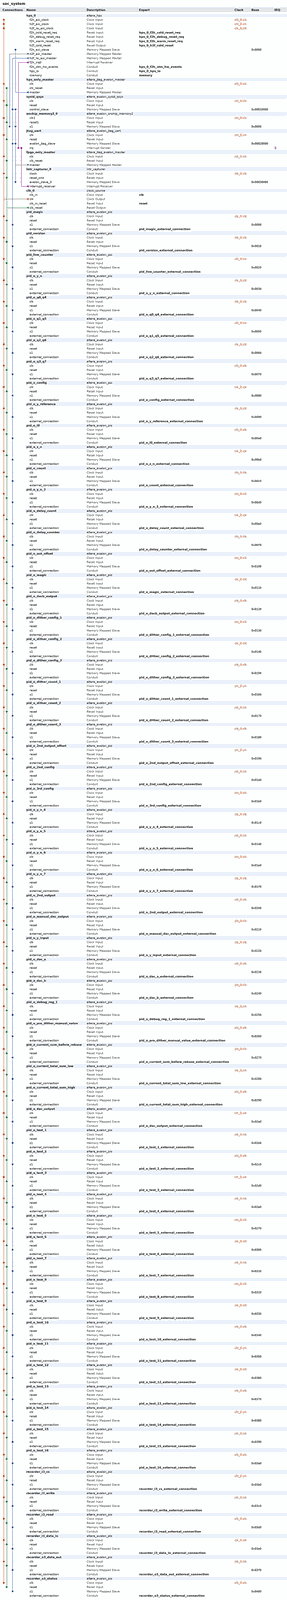
[diagram p0: system contents, whole]
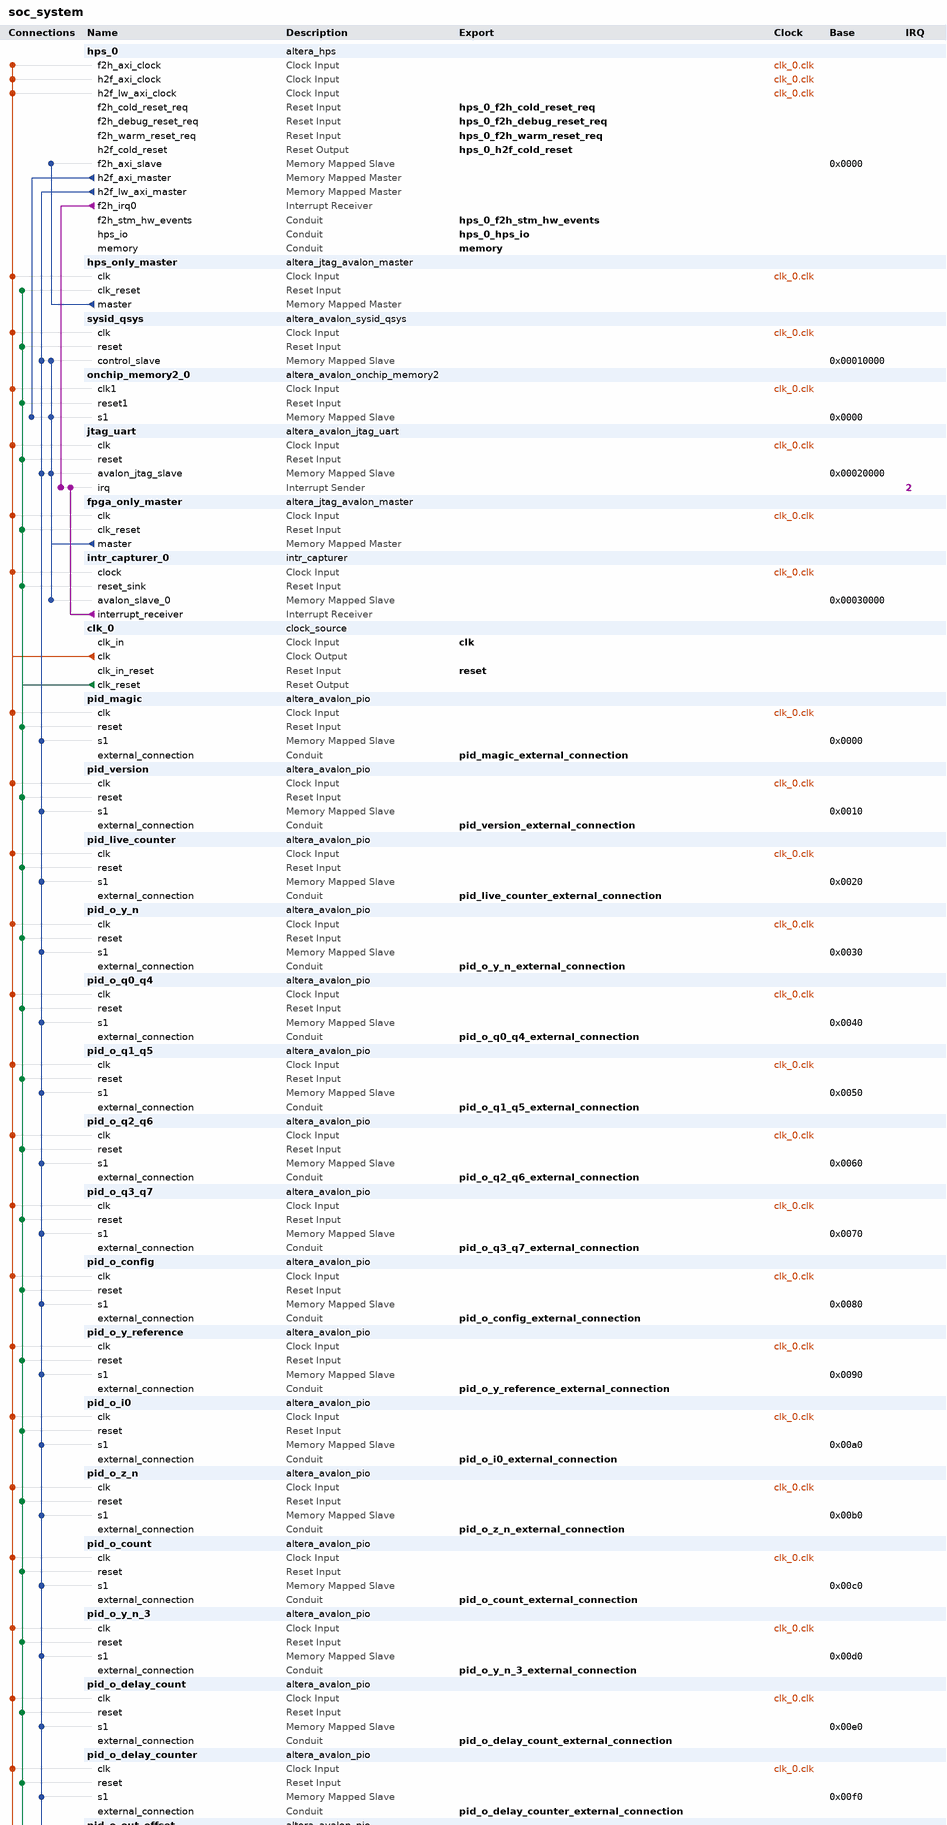
[diagram p1: system contents, upper part]
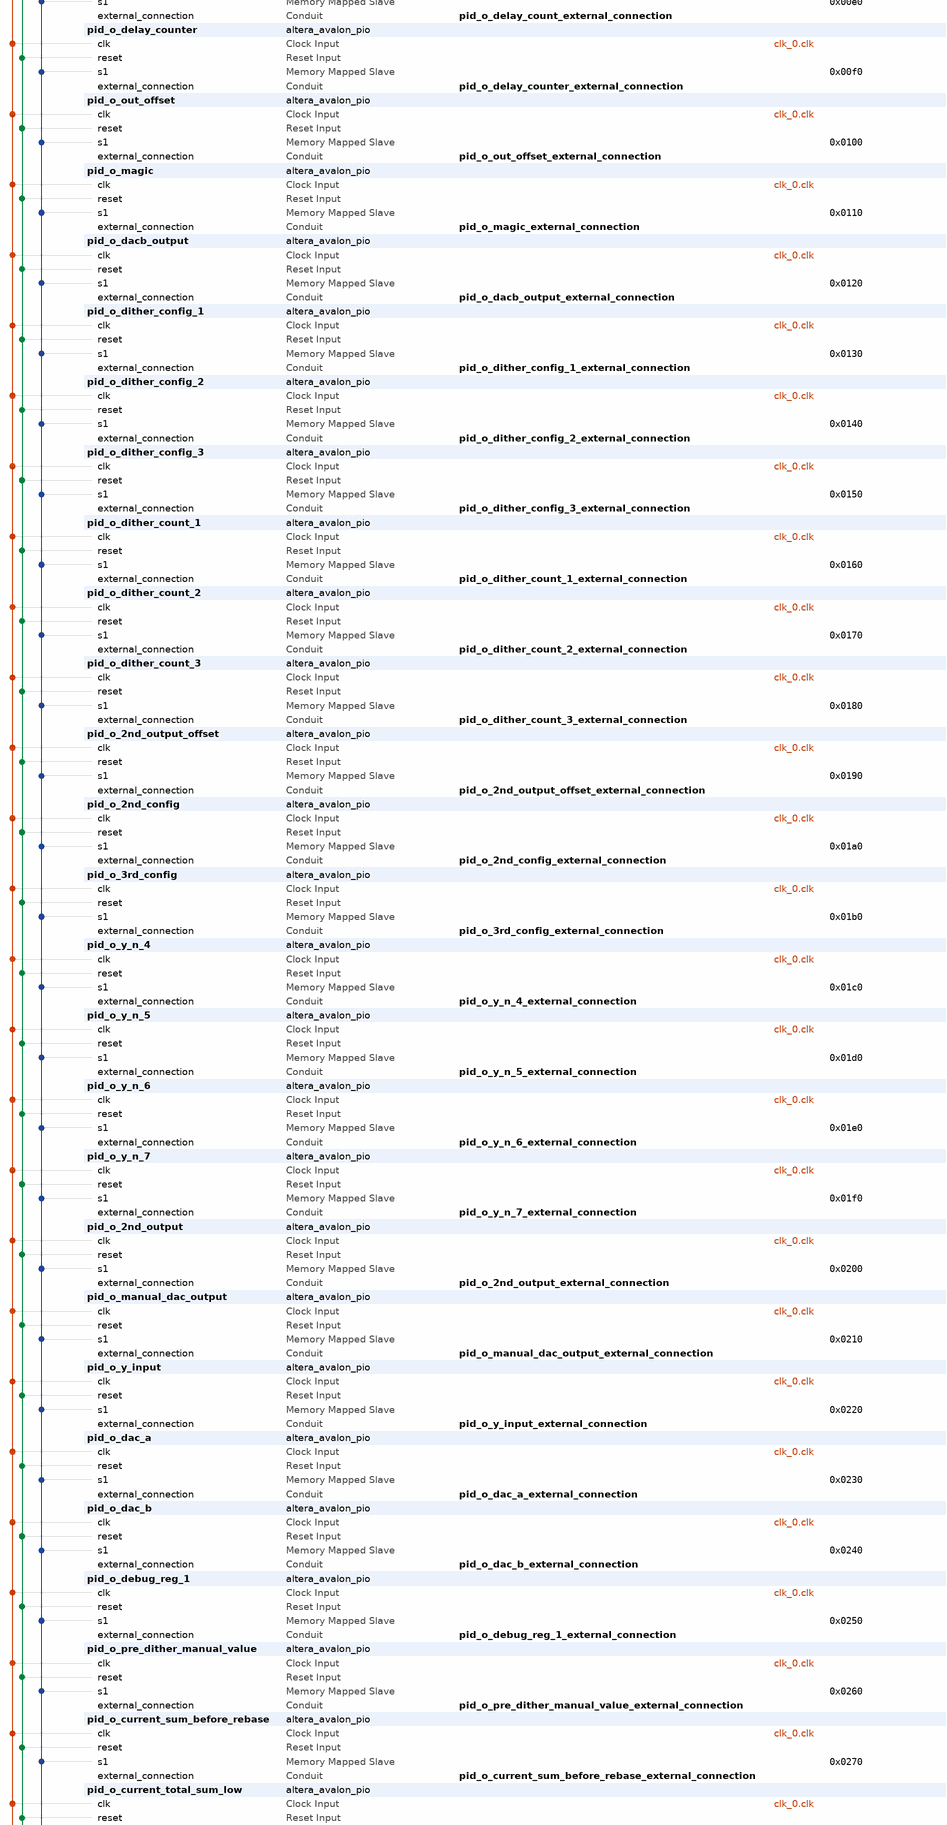
[diagram p2: system contents, middle part]
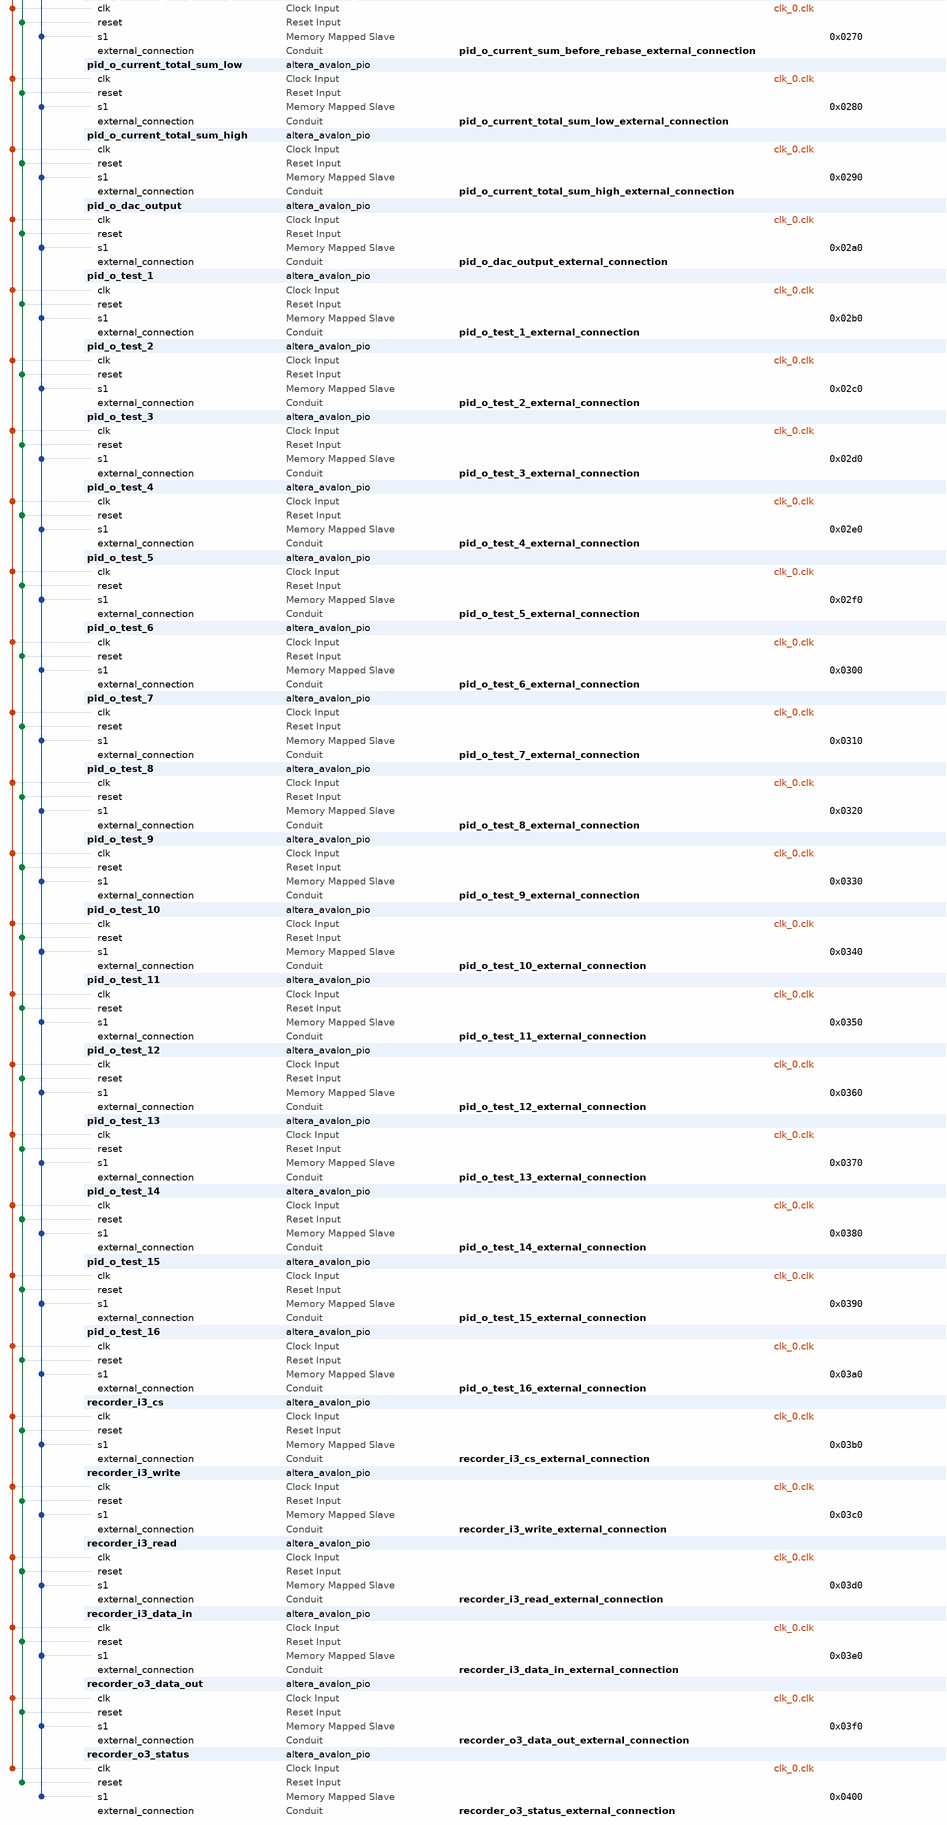
[diagram p3: system contents, lower part]
# Platform Designer (Qsys) system soc_system, Cyclone V 5CSEMA5F31C6
# Parameters at their usual value, and those the tool derives, are not listed.
package require -exact qsys 25.1
create_system soc_system
set_project_property DEVICE_FAMILY {Cyclone V}
set_project_property DEVICE 5CSEMA5F31C6

add_instance hps_0 altera_hps 25.1
set_instance_parameter_value hps_0 EMAC1_Mode RGMII
set_instance_parameter_value hps_0 EMAC1_PinMuxing {HPS I/O Set 0}
set_instance_parameter_value hps_0 F2SCLK_COLDRST_Enable true
set_instance_parameter_value hps_0 F2SCLK_DBGRST_Enable true
set_instance_parameter_value hps_0 F2SCLK_WARMRST_Enable true
set_instance_parameter_value hps_0 F2SINTERRUPT_Enable true
set_instance_parameter_value hps_0 F2S_Width 2
set_instance_parameter_value hps_0 FPGA_PERIPHERAL_OUTPUT_CLOCK_FREQ_EMAC0_GTX_CLK 100
set_instance_parameter_value hps_0 FPGA_PERIPHERAL_OUTPUT_CLOCK_FREQ_EMAC0_MD_CLK 100.0
set_instance_parameter_value hps_0 FPGA_PERIPHERAL_OUTPUT_CLOCK_FREQ_EMAC1_GTX_CLK 100
set_instance_parameter_value hps_0 FPGA_PERIPHERAL_OUTPUT_CLOCK_FREQ_EMAC1_MD_CLK 100.0
set_instance_parameter_value hps_0 HPS_PROTOCOL DDR3
set_instance_parameter_value hps_0 I2C0_Mode I2C
set_instance_parameter_value hps_0 I2C0_PinMuxing {HPS I/O Set 0}
set_instance_parameter_value hps_0 I2C1_Mode I2C
set_instance_parameter_value hps_0 I2C1_PinMuxing {HPS I/O Set 0}
set_instance_parameter_value hps_0 LWH2F_Enable true
set_instance_parameter_value hps_0 MEM_BANKADDR_WIDTH 3
set_instance_parameter_value hps_0 MEM_CLK_FREQ 400.0
set_instance_parameter_value hps_0 MEM_COL_ADDR_WIDTH 10
set_instance_parameter_value hps_0 MEM_DQ_WIDTH 32
set_instance_parameter_value hps_0 MEM_DRV_STR RZQ/7
set_instance_parameter_value hps_0 MEM_ROW_ADDR_WIDTH 15
set_instance_parameter_value hps_0 MEM_RTT_NOM RZQ/4
set_instance_parameter_value hps_0 MEM_RTT_WR RZQ/4
set_instance_parameter_value hps_0 MEM_TCL 11
set_instance_parameter_value hps_0 MEM_TFAW_NS 30.0
set_instance_parameter_value hps_0 MEM_TRAS_NS 35.0
set_instance_parameter_value hps_0 MEM_TRCD_NS 13.75
set_instance_parameter_value hps_0 MEM_TRFC_NS 260.0
set_instance_parameter_value hps_0 MEM_TRP_NS 13.75
set_instance_parameter_value hps_0 MEM_VENDOR JEDEC
set_instance_parameter_value hps_0 MEM_WTCL 8
set_instance_parameter_value hps_0 QSPI_Mode {1 SS}
set_instance_parameter_value hps_0 QSPI_PinMuxing {HPS I/O Set 0}
set_instance_parameter_value hps_0 REF_CLK_FREQ 25.0
set_instance_parameter_value hps_0 S2FCLK_COLDRST_Enable true
set_instance_parameter_value hps_0 S2FCLK_USER2CLK 5
set_instance_parameter_value hps_0 S2F_Width 2
set_instance_parameter_value hps_0 SDIO_Mode {4-bit Data}
set_instance_parameter_value hps_0 SDIO_PinMuxing {HPS I/O Set 0}
set_instance_parameter_value hps_0 SPIM1_Mode {Single Slave Select}
set_instance_parameter_value hps_0 SPIM1_PinMuxing {HPS I/O Set 0}
set_instance_parameter_value hps_0 STM_Enable true
set_instance_parameter_value hps_0 TIMING_BOARD_AC_SKEW 0.03
set_instance_parameter_value hps_0 TIMING_BOARD_AC_TO_CK_SKEW 0.0
set_instance_parameter_value hps_0 TIMING_BOARD_DQ_TO_DQS_SKEW 0.0
set_instance_parameter_value hps_0 TIMING_BOARD_MAX_CK_DELAY 0.03
set_instance_parameter_value hps_0 TIMING_BOARD_MAX_DQS_DELAY 0.02
set_instance_parameter_value hps_0 TIMING_BOARD_SKEW_BETWEEN_DQS 0.08
set_instance_parameter_value hps_0 TIMING_BOARD_SKEW_CKDQS_DIMM_MAX 0.16
set_instance_parameter_value hps_0 TIMING_BOARD_SKEW_CKDQS_DIMM_MIN 0.09
set_instance_parameter_value hps_0 TIMING_BOARD_SKEW_WITHIN_DQS 0.01
set_instance_parameter_value hps_0 TIMING_TDH 65
set_instance_parameter_value hps_0 TIMING_TDQSCK 255
set_instance_parameter_value hps_0 TIMING_TDQSQ 125
set_instance_parameter_value hps_0 TIMING_TDS 30
set_instance_parameter_value hps_0 TIMING_TIH 140
set_instance_parameter_value hps_0 TIMING_TIS 180
set_instance_parameter_value hps_0 TIMING_TQSH 0.4
set_instance_parameter_value hps_0 UART0_Mode {No Flow Control}
set_instance_parameter_value hps_0 UART0_PinMuxing {HPS I/O Set 0}
set_instance_parameter_value hps_0 USB1_Mode SDR
set_instance_parameter_value hps_0 USB1_PinMuxing {HPS I/O Set 0}
set_instance_parameter_value hps_0 desired_cfg_clk_mhz 100.0
set_instance_parameter_value hps_0 desired_qspi_clk_mhz 400.0

add_instance hps_only_master altera_jtag_avalon_master 25.1

add_instance sysid_qsys altera_avalon_sysid_qsys 25.1
set_instance_parameter_value sysid_qsys id -1395322110

add_instance onchip_memory2_0 altera_avalon_onchip_memory2 25.1
set_instance_parameter_value onchip_memory2_0 dataWidth 64
set_instance_parameter_value onchip_memory2_0 dualPort false
set_instance_parameter_value onchip_memory2_0 initMemContent true
set_instance_parameter_value onchip_memory2_0 initializationFileName onchip_memory2_0
set_instance_parameter_value onchip_memory2_0 memorySize 65536

add_instance jtag_uart altera_avalon_jtag_uart 25.1
set_instance_parameter_value jtag_uart allowMultipleConnections true
set_instance_parameter_value jtag_uart simInteractiveOptions INTERACTIVE_ASCII_OUTPUT

add_instance fpga_only_master altera_jtag_avalon_master 25.1

add_instance intr_capturer_0 intr_capturer 100.99.98.97

add_instance clk_0 clock_source 25.1
set_instance_parameter_value clk_0 clockFrequency 50000000

add_instance pid_magic altera_avalon_pio 25.1
set_instance_parameter_value pid_magic direction Input
set_instance_parameter_value pid_magic width 32

add_instance pid_version altera_avalon_pio 25.1
set_instance_parameter_value pid_version direction Input
set_instance_parameter_value pid_version width 32

add_instance pid_live_counter altera_avalon_pio 25.1
set_instance_parameter_value pid_live_counter direction Input
set_instance_parameter_value pid_live_counter width 32

add_instance pid_o_y_n altera_avalon_pio 25.1
set_instance_parameter_value pid_o_y_n direction InOut
set_instance_parameter_value pid_o_y_n width 32

add_instance pid_o_q0_q4 altera_avalon_pio 25.1
set_instance_parameter_value pid_o_q0_q4 direction InOut
set_instance_parameter_value pid_o_q0_q4 width 32

add_instance pid_o_q1_q5 altera_avalon_pio 25.1
set_instance_parameter_value pid_o_q1_q5 direction InOut
set_instance_parameter_value pid_o_q1_q5 width 32

add_instance pid_o_q2_q6 altera_avalon_pio 25.1
set_instance_parameter_value pid_o_q2_q6 direction InOut
set_instance_parameter_value pid_o_q2_q6 width 32

add_instance pid_o_q3_q7 altera_avalon_pio 25.1
set_instance_parameter_value pid_o_q3_q7 direction InOut
set_instance_parameter_value pid_o_q3_q7 width 32

add_instance pid_o_config altera_avalon_pio 25.1
set_instance_parameter_value pid_o_config direction InOut
set_instance_parameter_value pid_o_config width 32

add_instance pid_o_y_reference altera_avalon_pio 25.1
set_instance_parameter_value pid_o_y_reference direction InOut
set_instance_parameter_value pid_o_y_reference width 32

add_instance pid_o_i0 altera_avalon_pio 25.1
set_instance_parameter_value pid_o_i0 direction InOut
set_instance_parameter_value pid_o_i0 width 32

add_instance pid_o_z_n altera_avalon_pio 25.1
set_instance_parameter_value pid_o_z_n direction InOut
set_instance_parameter_value pid_o_z_n width 32

add_instance pid_o_count altera_avalon_pio 25.1
set_instance_parameter_value pid_o_count direction InOut
set_instance_parameter_value pid_o_count width 32

add_instance pid_o_y_n_3 altera_avalon_pio 25.1
set_instance_parameter_value pid_o_y_n_3 direction InOut
set_instance_parameter_value pid_o_y_n_3 width 32

add_instance pid_o_delay_count altera_avalon_pio 25.1
set_instance_parameter_value pid_o_delay_count direction InOut
set_instance_parameter_value pid_o_delay_count width 32

add_instance pid_o_delay_counter altera_avalon_pio 25.1
set_instance_parameter_value pid_o_delay_counter direction InOut
set_instance_parameter_value pid_o_delay_counter width 32

add_instance pid_o_out_offset altera_avalon_pio 25.1
set_instance_parameter_value pid_o_out_offset direction InOut
set_instance_parameter_value pid_o_out_offset width 32

add_instance pid_o_magic altera_avalon_pio 25.1
set_instance_parameter_value pid_o_magic direction InOut
set_instance_parameter_value pid_o_magic width 32

add_instance pid_o_dacb_output altera_avalon_pio 25.1
set_instance_parameter_value pid_o_dacb_output direction InOut
set_instance_parameter_value pid_o_dacb_output width 32

add_instance pid_o_dither_config_1 altera_avalon_pio 25.1
set_instance_parameter_value pid_o_dither_config_1 direction InOut
set_instance_parameter_value pid_o_dither_config_1 width 32

add_instance pid_o_dither_config_2 altera_avalon_pio 25.1
set_instance_parameter_value pid_o_dither_config_2 direction InOut
set_instance_parameter_value pid_o_dither_config_2 width 32

add_instance pid_o_dither_config_3 altera_avalon_pio 25.1
set_instance_parameter_value pid_o_dither_config_3 direction InOut
set_instance_parameter_value pid_o_dither_config_3 width 32

add_instance pid_o_dither_count_1 altera_avalon_pio 25.1
set_instance_parameter_value pid_o_dither_count_1 direction InOut
set_instance_parameter_value pid_o_dither_count_1 width 32

add_instance pid_o_dither_count_2 altera_avalon_pio 25.1
set_instance_parameter_value pid_o_dither_count_2 direction InOut
set_instance_parameter_value pid_o_dither_count_2 width 32

add_instance pid_o_dither_count_3 altera_avalon_pio 25.1
set_instance_parameter_value pid_o_dither_count_3 direction InOut
set_instance_parameter_value pid_o_dither_count_3 width 32

add_instance pid_o_2nd_output_offset altera_avalon_pio 25.1
set_instance_parameter_value pid_o_2nd_output_offset direction InOut
set_instance_parameter_value pid_o_2nd_output_offset width 32

add_instance pid_o_2nd_config altera_avalon_pio 25.1
set_instance_parameter_value pid_o_2nd_config direction InOut
set_instance_parameter_value pid_o_2nd_config width 32

add_instance pid_o_3rd_config altera_avalon_pio 25.1
set_instance_parameter_value pid_o_3rd_config direction InOut
set_instance_parameter_value pid_o_3rd_config width 32

add_instance pid_o_y_n_4 altera_avalon_pio 25.1
set_instance_parameter_value pid_o_y_n_4 direction InOut
set_instance_parameter_value pid_o_y_n_4 width 32

add_instance pid_o_y_n_5 altera_avalon_pio 25.1
set_instance_parameter_value pid_o_y_n_5 direction InOut
set_instance_parameter_value pid_o_y_n_5 width 32

add_instance pid_o_y_n_6 altera_avalon_pio 25.1
set_instance_parameter_value pid_o_y_n_6 direction InOut
set_instance_parameter_value pid_o_y_n_6 width 32

add_instance pid_o_y_n_7 altera_avalon_pio 25.1
set_instance_parameter_value pid_o_y_n_7 direction InOut
set_instance_parameter_value pid_o_y_n_7 width 32

add_instance pid_o_2nd_output altera_avalon_pio 25.1
set_instance_parameter_value pid_o_2nd_output direction InOut
set_instance_parameter_value pid_o_2nd_output width 32

add_instance pid_o_manual_dac_output altera_avalon_pio 25.1
set_instance_parameter_value pid_o_manual_dac_output direction InOut
set_instance_parameter_value pid_o_manual_dac_output width 32

add_instance pid_o_y_input altera_avalon_pio 25.1
set_instance_parameter_value pid_o_y_input direction InOut
set_instance_parameter_value pid_o_y_input width 32

add_instance pid_o_dac_a altera_avalon_pio 25.1
set_instance_parameter_value pid_o_dac_a direction InOut
set_instance_parameter_value pid_o_dac_a width 32

add_instance pid_o_dac_b altera_avalon_pio 25.1
set_instance_parameter_value pid_o_dac_b direction InOut
set_instance_parameter_value pid_o_dac_b width 32

add_instance pid_o_debug_reg_1 altera_avalon_pio 25.1
set_instance_parameter_value pid_o_debug_reg_1 direction Input
set_instance_parameter_value pid_o_debug_reg_1 width 32

add_instance pid_o_pre_dither_manual_value altera_avalon_pio 25.1
set_instance_parameter_value pid_o_pre_dither_manual_value direction InOut
set_instance_parameter_value pid_o_pre_dither_manual_value width 32

add_instance pid_o_current_sum_before_rebase altera_avalon_pio 25.1
set_instance_parameter_value pid_o_current_sum_before_rebase direction InOut
set_instance_parameter_value pid_o_current_sum_before_rebase width 32

add_instance pid_o_current_total_sum_low altera_avalon_pio 25.1
set_instance_parameter_value pid_o_current_total_sum_low direction InOut
set_instance_parameter_value pid_o_current_total_sum_low width 32

add_instance pid_o_current_total_sum_high altera_avalon_pio 25.1
set_instance_parameter_value pid_o_current_total_sum_high direction InOut
set_instance_parameter_value pid_o_current_total_sum_high width 32

add_instance pid_o_dac_output altera_avalon_pio 25.1
set_instance_parameter_value pid_o_dac_output direction InOut
set_instance_parameter_value pid_o_dac_output width 32

add_instance pid_o_test_1 altera_avalon_pio 25.1
set_instance_parameter_value pid_o_test_1 direction InOut
set_instance_parameter_value pid_o_test_1 width 32

add_instance pid_o_test_2 altera_avalon_pio 25.1
set_instance_parameter_value pid_o_test_2 direction InOut
set_instance_parameter_value pid_o_test_2 width 32

add_instance pid_o_test_3 altera_avalon_pio 25.1
set_instance_parameter_value pid_o_test_3 direction InOut
set_instance_parameter_value pid_o_test_3 width 32

add_instance pid_o_test_4 altera_avalon_pio 25.1
set_instance_parameter_value pid_o_test_4 direction InOut
set_instance_parameter_value pid_o_test_4 width 32

add_instance pid_o_test_5 altera_avalon_pio 25.1
set_instance_parameter_value pid_o_test_5 direction InOut
set_instance_parameter_value pid_o_test_5 width 32

add_instance pid_o_test_6 altera_avalon_pio 25.1
set_instance_parameter_value pid_o_test_6 direction InOut
set_instance_parameter_value pid_o_test_6 width 32

add_instance pid_o_test_7 altera_avalon_pio 25.1
set_instance_parameter_value pid_o_test_7 direction InOut
set_instance_parameter_value pid_o_test_7 width 32

add_instance pid_o_test_8 altera_avalon_pio 25.1
set_instance_parameter_value pid_o_test_8 direction InOut
set_instance_parameter_value pid_o_test_8 width 32

add_instance pid_o_test_9 altera_avalon_pio 25.1
set_instance_parameter_value pid_o_test_9 direction InOut
set_instance_parameter_value pid_o_test_9 width 32

add_instance pid_o_test_10 altera_avalon_pio 25.1
set_instance_parameter_value pid_o_test_10 direction InOut
set_instance_parameter_value pid_o_test_10 width 32

add_instance pid_o_test_11 altera_avalon_pio 25.1
set_instance_parameter_value pid_o_test_11 direction InOut
set_instance_parameter_value pid_o_test_11 width 32

add_instance pid_o_test_12 altera_avalon_pio 25.1
set_instance_parameter_value pid_o_test_12 direction InOut
set_instance_parameter_value pid_o_test_12 width 32

add_instance pid_o_test_13 altera_avalon_pio 25.1
set_instance_parameter_value pid_o_test_13 direction InOut
set_instance_parameter_value pid_o_test_13 width 32

add_instance pid_o_test_14 altera_avalon_pio 25.1
set_instance_parameter_value pid_o_test_14 direction InOut
set_instance_parameter_value pid_o_test_14 width 32

add_instance pid_o_test_15 altera_avalon_pio 25.1
set_instance_parameter_value pid_o_test_15 direction InOut
set_instance_parameter_value pid_o_test_15 width 32

add_instance pid_o_test_16 altera_avalon_pio 25.1
set_instance_parameter_value pid_o_test_16 direction InOut
set_instance_parameter_value pid_o_test_16 width 32

add_instance recorder_i3_cs altera_avalon_pio 25.1
set_instance_parameter_value recorder_i3_cs direction Output
set_instance_parameter_value recorder_i3_cs width 16

add_instance recorder_i3_write altera_avalon_pio 25.1
set_instance_parameter_value recorder_i3_write direction Output
set_instance_parameter_value recorder_i3_write width 1

add_instance recorder_i3_read altera_avalon_pio 25.1
set_instance_parameter_value recorder_i3_read direction Output
set_instance_parameter_value recorder_i3_read width 1

add_instance recorder_i3_data_in altera_avalon_pio 25.1
set_instance_parameter_value recorder_i3_data_in direction Output
set_instance_parameter_value recorder_i3_data_in width 32

add_instance recorder_o3_data_out altera_avalon_pio 25.1
set_instance_parameter_value recorder_o3_data_out direction Input
set_instance_parameter_value recorder_o3_data_out width 32

add_instance recorder_o3_status altera_avalon_pio 25.1
set_instance_parameter_value recorder_o3_status direction Input
set_instance_parameter_value recorder_o3_status width 32

# connections
add_connection clk_0.clk fpga_only_master.clk clock
add_connection clk_0.clk hps_0.f2h_axi_clock clock
add_connection clk_0.clk hps_0.h2f_axi_clock clock
add_connection clk_0.clk hps_0.h2f_lw_axi_clock clock
add_connection clk_0.clk hps_only_master.clk clock
add_connection clk_0.clk intr_capturer_0.clock clock
add_connection clk_0.clk jtag_uart.clk clock
add_connection clk_0.clk onchip_memory2_0.clk1 clock
add_connection clk_0.clk pid_live_counter.clk clock
add_connection clk_0.clk pid_magic.clk clock
add_connection clk_0.clk pid_o_2nd_config.clk clock
add_connection clk_0.clk pid_o_2nd_output.clk clock
add_connection clk_0.clk pid_o_2nd_output_offset.clk clock
add_connection clk_0.clk pid_o_3rd_config.clk clock
add_connection clk_0.clk pid_o_config.clk clock
add_connection clk_0.clk pid_o_count.clk clock
add_connection clk_0.clk pid_o_current_sum_before_rebase.clk clock
add_connection clk_0.clk pid_o_current_total_sum_high.clk clock
add_connection clk_0.clk pid_o_current_total_sum_low.clk clock
add_connection clk_0.clk pid_o_dac_a.clk clock
add_connection clk_0.clk pid_o_dac_b.clk clock
add_connection clk_0.clk pid_o_dac_output.clk clock
add_connection clk_0.clk pid_o_dacb_output.clk clock
add_connection clk_0.clk pid_o_debug_reg_1.clk clock
add_connection clk_0.clk pid_o_delay_count.clk clock
add_connection clk_0.clk pid_o_delay_counter.clk clock
add_connection clk_0.clk pid_o_dither_config_1.clk clock
add_connection clk_0.clk pid_o_dither_config_2.clk clock
add_connection clk_0.clk pid_o_dither_config_3.clk clock
add_connection clk_0.clk pid_o_dither_count_1.clk clock
add_connection clk_0.clk pid_o_dither_count_2.clk clock
add_connection clk_0.clk pid_o_dither_count_3.clk clock
add_connection clk_0.clk pid_o_i0.clk clock
add_connection clk_0.clk pid_o_magic.clk clock
add_connection clk_0.clk pid_o_manual_dac_output.clk clock
add_connection clk_0.clk pid_o_out_offset.clk clock
add_connection clk_0.clk pid_o_pre_dither_manual_value.clk clock
add_connection clk_0.clk pid_o_q0_q4.clk clock
add_connection clk_0.clk pid_o_q1_q5.clk clock
add_connection clk_0.clk pid_o_q2_q6.clk clock
add_connection clk_0.clk pid_o_q3_q7.clk clock
add_connection clk_0.clk pid_o_test_1.clk clock
add_connection clk_0.clk pid_o_test_2.clk clock
add_connection clk_0.clk pid_o_test_3.clk clock
add_connection clk_0.clk pid_o_test_4.clk clock
add_connection clk_0.clk pid_o_test_5.clk clock
add_connection clk_0.clk pid_o_test_6.clk clock
add_connection clk_0.clk pid_o_test_7.clk clock
add_connection clk_0.clk pid_o_test_8.clk clock
add_connection clk_0.clk pid_o_test_9.clk clock
add_connection clk_0.clk pid_o_test_10.clk clock
add_connection clk_0.clk pid_o_test_11.clk clock
add_connection clk_0.clk pid_o_test_12.clk clock
add_connection clk_0.clk pid_o_test_13.clk clock
add_connection clk_0.clk pid_o_test_14.clk clock
add_connection clk_0.clk pid_o_test_15.clk clock
add_connection clk_0.clk pid_o_test_16.clk clock
add_connection clk_0.clk pid_o_y_input.clk clock
add_connection clk_0.clk pid_o_y_n.clk clock
add_connection clk_0.clk pid_o_y_n_3.clk clock
add_connection clk_0.clk pid_o_y_n_4.clk clock
add_connection clk_0.clk pid_o_y_n_5.clk clock
add_connection clk_0.clk pid_o_y_n_6.clk clock
add_connection clk_0.clk pid_o_y_n_7.clk clock
add_connection clk_0.clk pid_o_y_reference.clk clock
add_connection clk_0.clk pid_o_z_n.clk clock
add_connection clk_0.clk pid_version.clk clock
add_connection clk_0.clk recorder_i3_cs.clk clock
add_connection clk_0.clk recorder_i3_data_in.clk clock
add_connection clk_0.clk recorder_i3_read.clk clock
add_connection clk_0.clk recorder_i3_write.clk clock
add_connection clk_0.clk recorder_o3_data_out.clk clock
add_connection clk_0.clk recorder_o3_status.clk clock
add_connection clk_0.clk sysid_qsys.clk clock
add_connection clk_0.clk_reset fpga_only_master.clk_reset reset
add_connection clk_0.clk_reset hps_only_master.clk_reset reset
add_connection clk_0.clk_reset intr_capturer_0.reset_sink reset
add_connection clk_0.clk_reset jtag_uart.reset reset
add_connection clk_0.clk_reset onchip_memory2_0.reset1 reset
add_connection clk_0.clk_reset pid_live_counter.reset reset
add_connection clk_0.clk_reset pid_magic.reset reset
add_connection clk_0.clk_reset pid_o_2nd_config.reset reset
add_connection clk_0.clk_reset pid_o_2nd_output.reset reset
add_connection clk_0.clk_reset pid_o_2nd_output_offset.reset reset
add_connection clk_0.clk_reset pid_o_3rd_config.reset reset
add_connection clk_0.clk_reset pid_o_config.reset reset
add_connection clk_0.clk_reset pid_o_count.reset reset
add_connection clk_0.clk_reset pid_o_current_sum_before_rebase.reset reset
add_connection clk_0.clk_reset pid_o_current_total_sum_high.reset reset
add_connection clk_0.clk_reset pid_o_current_total_sum_low.reset reset
add_connection clk_0.clk_reset pid_o_dac_a.reset reset
add_connection clk_0.clk_reset pid_o_dac_b.reset reset
add_connection clk_0.clk_reset pid_o_dac_output.reset reset
add_connection clk_0.clk_reset pid_o_dacb_output.reset reset
add_connection clk_0.clk_reset pid_o_debug_reg_1.reset reset
add_connection clk_0.clk_reset pid_o_delay_count.reset reset
add_connection clk_0.clk_reset pid_o_delay_counter.reset reset
add_connection clk_0.clk_reset pid_o_dither_config_1.reset reset
add_connection clk_0.clk_reset pid_o_dither_config_2.reset reset
add_connection clk_0.clk_reset pid_o_dither_config_3.reset reset
add_connection clk_0.clk_reset pid_o_dither_count_1.reset reset
add_connection clk_0.clk_reset pid_o_dither_count_2.reset reset
add_connection clk_0.clk_reset pid_o_dither_count_3.reset reset
add_connection clk_0.clk_reset pid_o_i0.reset reset
add_connection clk_0.clk_reset pid_o_magic.reset reset
add_connection clk_0.clk_reset pid_o_manual_dac_output.reset reset
add_connection clk_0.clk_reset pid_o_out_offset.reset reset
add_connection clk_0.clk_reset pid_o_pre_dither_manual_value.reset reset
add_connection clk_0.clk_reset pid_o_q0_q4.reset reset
add_connection clk_0.clk_reset pid_o_q1_q5.reset reset
add_connection clk_0.clk_reset pid_o_q2_q6.reset reset
add_connection clk_0.clk_reset pid_o_q3_q7.reset reset
add_connection clk_0.clk_reset pid_o_test_1.reset reset
add_connection clk_0.clk_reset pid_o_test_2.reset reset
add_connection clk_0.clk_reset pid_o_test_3.reset reset
add_connection clk_0.clk_reset pid_o_test_4.reset reset
add_connection clk_0.clk_reset pid_o_test_5.reset reset
add_connection clk_0.clk_reset pid_o_test_6.reset reset
add_connection clk_0.clk_reset pid_o_test_7.reset reset
add_connection clk_0.clk_reset pid_o_test_8.reset reset
add_connection clk_0.clk_reset pid_o_test_9.reset reset
add_connection clk_0.clk_reset pid_o_test_10.reset reset
add_connection clk_0.clk_reset pid_o_test_11.reset reset
add_connection clk_0.clk_reset pid_o_test_12.reset reset
add_connection clk_0.clk_reset pid_o_test_13.reset reset
add_connection clk_0.clk_reset pid_o_test_14.reset reset
add_connection clk_0.clk_reset pid_o_test_15.reset reset
add_connection clk_0.clk_reset pid_o_test_16.reset reset
add_connection clk_0.clk_reset pid_o_y_input.reset reset
add_connection clk_0.clk_reset pid_o_y_n.reset reset
add_connection clk_0.clk_reset pid_o_y_n_3.reset reset
add_connection clk_0.clk_reset pid_o_y_n_4.reset reset
add_connection clk_0.clk_reset pid_o_y_n_5.reset reset
add_connection clk_0.clk_reset pid_o_y_n_6.reset reset
add_connection clk_0.clk_reset pid_o_y_n_7.reset reset
add_connection clk_0.clk_reset pid_o_y_reference.reset reset
add_connection clk_0.clk_reset pid_o_z_n.reset reset
add_connection clk_0.clk_reset pid_version.reset reset
add_connection clk_0.clk_reset recorder_i3_cs.reset reset
add_connection clk_0.clk_reset recorder_i3_data_in.reset reset
add_connection clk_0.clk_reset recorder_i3_read.reset reset
add_connection clk_0.clk_reset recorder_i3_write.reset reset
add_connection clk_0.clk_reset recorder_o3_data_out.reset reset
add_connection clk_0.clk_reset recorder_o3_status.reset reset
add_connection clk_0.clk_reset sysid_qsys.reset reset
add_connection fpga_only_master.master intr_capturer_0.avalon_slave_0 avalon
set_connection_parameter_value fpga_only_master.master/intr_capturer_0.avalon_slave_0 baseAddress 0x00030000
add_connection fpga_only_master.master jtag_uart.avalon_jtag_slave avalon
set_connection_parameter_value fpga_only_master.master/jtag_uart.avalon_jtag_slave baseAddress 0x00020000
add_connection fpga_only_master.master onchip_memory2_0.s1 avalon
set_connection_parameter_value fpga_only_master.master/onchip_memory2_0.s1 baseAddress 0x0000
add_connection fpga_only_master.master sysid_qsys.control_slave avalon
set_connection_parameter_value fpga_only_master.master/sysid_qsys.control_slave baseAddress 0x00010000
add_connection hps_0.h2f_axi_master onchip_memory2_0.s1 avalon
set_connection_parameter_value hps_0.h2f_axi_master/onchip_memory2_0.s1 baseAddress 0x0000
add_connection hps_0.h2f_lw_axi_master jtag_uart.avalon_jtag_slave avalon
set_connection_parameter_value hps_0.h2f_lw_axi_master/jtag_uart.avalon_jtag_slave baseAddress 0x00020000
add_connection hps_0.h2f_lw_axi_master pid_live_counter.s1 avalon
set_connection_parameter_value hps_0.h2f_lw_axi_master/pid_live_counter.s1 baseAddress 0x0020
add_connection hps_0.h2f_lw_axi_master pid_magic.s1 avalon
set_connection_parameter_value hps_0.h2f_lw_axi_master/pid_magic.s1 baseAddress 0x0000
add_connection hps_0.h2f_lw_axi_master pid_o_2nd_config.s1 avalon
set_connection_parameter_value hps_0.h2f_lw_axi_master/pid_o_2nd_config.s1 baseAddress 0x01a0
add_connection hps_0.h2f_lw_axi_master pid_o_2nd_output.s1 avalon
set_connection_parameter_value hps_0.h2f_lw_axi_master/pid_o_2nd_output.s1 baseAddress 0x0200
add_connection hps_0.h2f_lw_axi_master pid_o_2nd_output_offset.s1 avalon
set_connection_parameter_value hps_0.h2f_lw_axi_master/pid_o_2nd_output_offset.s1 baseAddress 0x0190
add_connection hps_0.h2f_lw_axi_master pid_o_3rd_config.s1 avalon
set_connection_parameter_value hps_0.h2f_lw_axi_master/pid_o_3rd_config.s1 baseAddress 0x01b0
add_connection hps_0.h2f_lw_axi_master pid_o_config.s1 avalon
set_connection_parameter_value hps_0.h2f_lw_axi_master/pid_o_config.s1 baseAddress 0x0080
add_connection hps_0.h2f_lw_axi_master pid_o_count.s1 avalon
set_connection_parameter_value hps_0.h2f_lw_axi_master/pid_o_count.s1 baseAddress 0x00c0
add_connection hps_0.h2f_lw_axi_master pid_o_current_sum_before_rebase.s1 avalon
set_connection_parameter_value hps_0.h2f_lw_axi_master/pid_o_current_sum_before_rebase.s1 baseAddress 0x0270
add_connection hps_0.h2f_lw_axi_master pid_o_current_total_sum_high.s1 avalon
set_connection_parameter_value hps_0.h2f_lw_axi_master/pid_o_current_total_sum_high.s1 baseAddress 0x0290
add_connection hps_0.h2f_lw_axi_master pid_o_current_total_sum_low.s1 avalon
set_connection_parameter_value hps_0.h2f_lw_axi_master/pid_o_current_total_sum_low.s1 baseAddress 0x0280
add_connection hps_0.h2f_lw_axi_master pid_o_dac_a.s1 avalon
set_connection_parameter_value hps_0.h2f_lw_axi_master/pid_o_dac_a.s1 baseAddress 0x0230
add_connection hps_0.h2f_lw_axi_master pid_o_dac_b.s1 avalon
set_connection_parameter_value hps_0.h2f_lw_axi_master/pid_o_dac_b.s1 baseAddress 0x0240
add_connection hps_0.h2f_lw_axi_master pid_o_dac_output.s1 avalon
set_connection_parameter_value hps_0.h2f_lw_axi_master/pid_o_dac_output.s1 baseAddress 0x02a0
add_connection hps_0.h2f_lw_axi_master pid_o_dacb_output.s1 avalon
set_connection_parameter_value hps_0.h2f_lw_axi_master/pid_o_dacb_output.s1 baseAddress 0x0120
add_connection hps_0.h2f_lw_axi_master pid_o_debug_reg_1.s1 avalon
set_connection_parameter_value hps_0.h2f_lw_axi_master/pid_o_debug_reg_1.s1 baseAddress 0x0250
add_connection hps_0.h2f_lw_axi_master pid_o_delay_count.s1 avalon
set_connection_parameter_value hps_0.h2f_lw_axi_master/pid_o_delay_count.s1 baseAddress 0x00e0
add_connection hps_0.h2f_lw_axi_master pid_o_delay_counter.s1 avalon
set_connection_parameter_value hps_0.h2f_lw_axi_master/pid_o_delay_counter.s1 baseAddress 0x00f0
add_connection hps_0.h2f_lw_axi_master pid_o_dither_config_1.s1 avalon
set_connection_parameter_value hps_0.h2f_lw_axi_master/pid_o_dither_config_1.s1 baseAddress 0x0130
add_connection hps_0.h2f_lw_axi_master pid_o_dither_config_2.s1 avalon
set_connection_parameter_value hps_0.h2f_lw_axi_master/pid_o_dither_config_2.s1 baseAddress 0x0140
add_connection hps_0.h2f_lw_axi_master pid_o_dither_config_3.s1 avalon
set_connection_parameter_value hps_0.h2f_lw_axi_master/pid_o_dither_config_3.s1 baseAddress 0x0150
add_connection hps_0.h2f_lw_axi_master pid_o_dither_count_1.s1 avalon
set_connection_parameter_value hps_0.h2f_lw_axi_master/pid_o_dither_count_1.s1 baseAddress 0x0160
add_connection hps_0.h2f_lw_axi_master pid_o_dither_count_2.s1 avalon
set_connection_parameter_value hps_0.h2f_lw_axi_master/pid_o_dither_count_2.s1 baseAddress 0x0170
add_connection hps_0.h2f_lw_axi_master pid_o_dither_count_3.s1 avalon
set_connection_parameter_value hps_0.h2f_lw_axi_master/pid_o_dither_count_3.s1 baseAddress 0x0180
add_connection hps_0.h2f_lw_axi_master pid_o_i0.s1 avalon
set_connection_parameter_value hps_0.h2f_lw_axi_master/pid_o_i0.s1 baseAddress 0x00a0
add_connection hps_0.h2f_lw_axi_master pid_o_magic.s1 avalon
set_connection_parameter_value hps_0.h2f_lw_axi_master/pid_o_magic.s1 baseAddress 0x0110
add_connection hps_0.h2f_lw_axi_master pid_o_manual_dac_output.s1 avalon
set_connection_parameter_value hps_0.h2f_lw_axi_master/pid_o_manual_dac_output.s1 baseAddress 0x0210
add_connection hps_0.h2f_lw_axi_master pid_o_out_offset.s1 avalon
set_connection_parameter_value hps_0.h2f_lw_axi_master/pid_o_out_offset.s1 baseAddress 0x0100
add_connection hps_0.h2f_lw_axi_master pid_o_pre_dither_manual_value.s1 avalon
set_connection_parameter_value hps_0.h2f_lw_axi_master/pid_o_pre_dither_manual_value.s1 baseAddress 0x0260
add_connection hps_0.h2f_lw_axi_master pid_o_q0_q4.s1 avalon
set_connection_parameter_value hps_0.h2f_lw_axi_master/pid_o_q0_q4.s1 baseAddress 0x0040
add_connection hps_0.h2f_lw_axi_master pid_o_q1_q5.s1 avalon
set_connection_parameter_value hps_0.h2f_lw_axi_master/pid_o_q1_q5.s1 baseAddress 0x0050
add_connection hps_0.h2f_lw_axi_master pid_o_q2_q6.s1 avalon
set_connection_parameter_value hps_0.h2f_lw_axi_master/pid_o_q2_q6.s1 baseAddress 0x0060
add_connection hps_0.h2f_lw_axi_master pid_o_q3_q7.s1 avalon
set_connection_parameter_value hps_0.h2f_lw_axi_master/pid_o_q3_q7.s1 baseAddress 0x0070
add_connection hps_0.h2f_lw_axi_master pid_o_test_1.s1 avalon
set_connection_parameter_value hps_0.h2f_lw_axi_master/pid_o_test_1.s1 baseAddress 0x02b0
add_connection hps_0.h2f_lw_axi_master pid_o_test_2.s1 avalon
set_connection_parameter_value hps_0.h2f_lw_axi_master/pid_o_test_2.s1 baseAddress 0x02c0
add_connection hps_0.h2f_lw_axi_master pid_o_test_3.s1 avalon
set_connection_parameter_value hps_0.h2f_lw_axi_master/pid_o_test_3.s1 baseAddress 0x02d0
add_connection hps_0.h2f_lw_axi_master pid_o_test_4.s1 avalon
set_connection_parameter_value hps_0.h2f_lw_axi_master/pid_o_test_4.s1 baseAddress 0x02e0
add_connection hps_0.h2f_lw_axi_master pid_o_test_5.s1 avalon
set_connection_parameter_value hps_0.h2f_lw_axi_master/pid_o_test_5.s1 baseAddress 0x02f0
add_connection hps_0.h2f_lw_axi_master pid_o_test_6.s1 avalon
set_connection_parameter_value hps_0.h2f_lw_axi_master/pid_o_test_6.s1 baseAddress 0x0300
add_connection hps_0.h2f_lw_axi_master pid_o_test_7.s1 avalon
set_connection_parameter_value hps_0.h2f_lw_axi_master/pid_o_test_7.s1 baseAddress 0x0310
add_connection hps_0.h2f_lw_axi_master pid_o_test_8.s1 avalon
set_connection_parameter_value hps_0.h2f_lw_axi_master/pid_o_test_8.s1 baseAddress 0x0320
add_connection hps_0.h2f_lw_axi_master pid_o_test_9.s1 avalon
set_connection_parameter_value hps_0.h2f_lw_axi_master/pid_o_test_9.s1 baseAddress 0x0330
add_connection hps_0.h2f_lw_axi_master pid_o_test_10.s1 avalon
set_connection_parameter_value hps_0.h2f_lw_axi_master/pid_o_test_10.s1 baseAddress 0x0340
add_connection hps_0.h2f_lw_axi_master pid_o_test_11.s1 avalon
set_connection_parameter_value hps_0.h2f_lw_axi_master/pid_o_test_11.s1 baseAddress 0x0350
add_connection hps_0.h2f_lw_axi_master pid_o_test_12.s1 avalon
set_connection_parameter_value hps_0.h2f_lw_axi_master/pid_o_test_12.s1 baseAddress 0x0360
add_connection hps_0.h2f_lw_axi_master pid_o_test_13.s1 avalon
set_connection_parameter_value hps_0.h2f_lw_axi_master/pid_o_test_13.s1 baseAddress 0x0370
add_connection hps_0.h2f_lw_axi_master pid_o_test_14.s1 avalon
set_connection_parameter_value hps_0.h2f_lw_axi_master/pid_o_test_14.s1 baseAddress 0x0380
add_connection hps_0.h2f_lw_axi_master pid_o_test_15.s1 avalon
set_connection_parameter_value hps_0.h2f_lw_axi_master/pid_o_test_15.s1 baseAddress 0x0390
add_connection hps_0.h2f_lw_axi_master pid_o_test_16.s1 avalon
set_connection_parameter_value hps_0.h2f_lw_axi_master/pid_o_test_16.s1 baseAddress 0x03a0
add_connection hps_0.h2f_lw_axi_master pid_o_y_input.s1 avalon
set_connection_parameter_value hps_0.h2f_lw_axi_master/pid_o_y_input.s1 baseAddress 0x0220
add_connection hps_0.h2f_lw_axi_master pid_o_y_n.s1 avalon
set_connection_parameter_value hps_0.h2f_lw_axi_master/pid_o_y_n.s1 baseAddress 0x0030
add_connection hps_0.h2f_lw_axi_master pid_o_y_n_3.s1 avalon
set_connection_parameter_value hps_0.h2f_lw_axi_master/pid_o_y_n_3.s1 baseAddress 0x00d0
add_connection hps_0.h2f_lw_axi_master pid_o_y_n_4.s1 avalon
set_connection_parameter_value hps_0.h2f_lw_axi_master/pid_o_y_n_4.s1 baseAddress 0x01c0
add_connection hps_0.h2f_lw_axi_master pid_o_y_n_5.s1 avalon
set_connection_parameter_value hps_0.h2f_lw_axi_master/pid_o_y_n_5.s1 baseAddress 0x01d0
add_connection hps_0.h2f_lw_axi_master pid_o_y_n_6.s1 avalon
set_connection_parameter_value hps_0.h2f_lw_axi_master/pid_o_y_n_6.s1 baseAddress 0x01e0
add_connection hps_0.h2f_lw_axi_master pid_o_y_n_7.s1 avalon
set_connection_parameter_value hps_0.h2f_lw_axi_master/pid_o_y_n_7.s1 baseAddress 0x01f0
add_connection hps_0.h2f_lw_axi_master pid_o_y_reference.s1 avalon
set_connection_parameter_value hps_0.h2f_lw_axi_master/pid_o_y_reference.s1 baseAddress 0x0090
add_connection hps_0.h2f_lw_axi_master pid_o_z_n.s1 avalon
set_connection_parameter_value hps_0.h2f_lw_axi_master/pid_o_z_n.s1 baseAddress 0x00b0
add_connection hps_0.h2f_lw_axi_master pid_version.s1 avalon
set_connection_parameter_value hps_0.h2f_lw_axi_master/pid_version.s1 baseAddress 0x0010
add_connection hps_0.h2f_lw_axi_master recorder_i3_cs.s1 avalon
set_connection_parameter_value hps_0.h2f_lw_axi_master/recorder_i3_cs.s1 baseAddress 0x03b0
add_connection hps_0.h2f_lw_axi_master recorder_i3_data_in.s1 avalon
set_connection_parameter_value hps_0.h2f_lw_axi_master/recorder_i3_data_in.s1 baseAddress 0x03e0
add_connection hps_0.h2f_lw_axi_master recorder_i3_read.s1 avalon
set_connection_parameter_value hps_0.h2f_lw_axi_master/recorder_i3_read.s1 baseAddress 0x03d0
add_connection hps_0.h2f_lw_axi_master recorder_i3_write.s1 avalon
set_connection_parameter_value hps_0.h2f_lw_axi_master/recorder_i3_write.s1 baseAddress 0x03c0
add_connection hps_0.h2f_lw_axi_master recorder_o3_data_out.s1 avalon
set_connection_parameter_value hps_0.h2f_lw_axi_master/recorder_o3_data_out.s1 baseAddress 0x03f0
add_connection hps_0.h2f_lw_axi_master recorder_o3_status.s1 avalon
set_connection_parameter_value hps_0.h2f_lw_axi_master/recorder_o3_status.s1 baseAddress 0x0400
add_connection hps_0.h2f_lw_axi_master sysid_qsys.control_slave avalon
set_connection_parameter_value hps_0.h2f_lw_axi_master/sysid_qsys.control_slave baseAddress 0x00010000
add_connection hps_only_master.master hps_0.f2h_axi_slave avalon
set_connection_parameter_value hps_only_master.master/hps_0.f2h_axi_slave baseAddress 0x0000
add_connection hps_0.f2h_irq0 jtag_uart.irq interrupt
set_connection_parameter_value hps_0.f2h_irq0/jtag_uart.irq irqNumber 2
add_connection intr_capturer_0.interrupt_receiver jtag_uart.irq interrupt
set_connection_parameter_value intr_capturer_0.interrupt_receiver/jtag_uart.irq irqNumber 2

# exported interfaces
add_interface clk clock sink
set_interface_property clk EXPORT_OF clk_0.clk_in
add_interface hps_0_f2h_cold_reset_req reset sink
set_interface_property hps_0_f2h_cold_reset_req EXPORT_OF hps_0.f2h_cold_reset_req
add_interface hps_0_f2h_debug_reset_req reset sink
set_interface_property hps_0_f2h_debug_reset_req EXPORT_OF hps_0.f2h_debug_reset_req
add_interface hps_0_f2h_stm_hw_events conduit end
set_interface_property hps_0_f2h_stm_hw_events EXPORT_OF hps_0.f2h_stm_hw_events
add_interface hps_0_f2h_warm_reset_req reset sink
set_interface_property hps_0_f2h_warm_reset_req EXPORT_OF hps_0.f2h_warm_reset_req
add_interface hps_0_h2f_cold_reset reset source
set_interface_property hps_0_h2f_cold_reset EXPORT_OF hps_0.h2f_cold_reset
add_interface hps_0_hps_io conduit end
set_interface_property hps_0_hps_io EXPORT_OF hps_0.hps_io
add_interface memory conduit end
set_interface_property memory EXPORT_OF hps_0.memory
add_interface pid_live_counter_external_connection conduit end
set_interface_property pid_live_counter_external_connection EXPORT_OF pid_live_counter.external_connection
add_interface pid_magic_external_connection conduit end
set_interface_property pid_magic_external_connection EXPORT_OF pid_magic.external_connection
add_interface pid_o_2nd_config_external_connection conduit end
set_interface_property pid_o_2nd_config_external_connection EXPORT_OF pid_o_2nd_config.external_connection
add_interface pid_o_2nd_output_external_connection conduit end
set_interface_property pid_o_2nd_output_external_connection EXPORT_OF pid_o_2nd_output.external_connection
add_interface pid_o_2nd_output_offset_external_connection conduit end
set_interface_property pid_o_2nd_output_offset_external_connection EXPORT_OF pid_o_2nd_output_offset.external_connection
add_interface pid_o_3rd_config_external_connection conduit end
set_interface_property pid_o_3rd_config_external_connection EXPORT_OF pid_o_3rd_config.external_connection
add_interface pid_o_config_external_connection conduit end
set_interface_property pid_o_config_external_connection EXPORT_OF pid_o_config.external_connection
add_interface pid_o_count_external_connection conduit end
set_interface_property pid_o_count_external_connection EXPORT_OF pid_o_count.external_connection
add_interface pid_o_current_sum_before_rebase_external_connection conduit end
set_interface_property pid_o_current_sum_before_rebase_external_connection EXPORT_OF pid_o_current_sum_before_rebase.external_connection
add_interface pid_o_current_total_sum_high_external_connection conduit end
set_interface_property pid_o_current_total_sum_high_external_connection EXPORT_OF pid_o_current_total_sum_high.external_connection
add_interface pid_o_current_total_sum_low_external_connection conduit end
set_interface_property pid_o_current_total_sum_low_external_connection EXPORT_OF pid_o_current_total_sum_low.external_connection
add_interface pid_o_dac_a_external_connection conduit end
set_interface_property pid_o_dac_a_external_connection EXPORT_OF pid_o_dac_a.external_connection
add_interface pid_o_dac_b_external_connection conduit end
set_interface_property pid_o_dac_b_external_connection EXPORT_OF pid_o_dac_b.external_connection
add_interface pid_o_dac_output_external_connection conduit end
set_interface_property pid_o_dac_output_external_connection EXPORT_OF pid_o_dac_output.external_connection
add_interface pid_o_dacb_output_external_connection conduit end
set_interface_property pid_o_dacb_output_external_connection EXPORT_OF pid_o_dacb_output.external_connection
add_interface pid_o_debug_reg_1_external_connection conduit end
set_interface_property pid_o_debug_reg_1_external_connection EXPORT_OF pid_o_debug_reg_1.external_connection
add_interface pid_o_delay_count_external_connection conduit end
set_interface_property pid_o_delay_count_external_connection EXPORT_OF pid_o_delay_count.external_connection
add_interface pid_o_delay_counter_external_connection conduit end
set_interface_property pid_o_delay_counter_external_connection EXPORT_OF pid_o_delay_counter.external_connection
add_interface pid_o_dither_config_1_external_connection conduit end
set_interface_property pid_o_dither_config_1_external_connection EXPORT_OF pid_o_dither_config_1.external_connection
add_interface pid_o_dither_config_2_external_connection conduit end
set_interface_property pid_o_dither_config_2_external_connection EXPORT_OF pid_o_dither_config_2.external_connection
add_interface pid_o_dither_config_3_external_connection conduit end
set_interface_property pid_o_dither_config_3_external_connection EXPORT_OF pid_o_dither_config_3.external_connection
add_interface pid_o_dither_count_1_external_connection conduit end
set_interface_property pid_o_dither_count_1_external_connection EXPORT_OF pid_o_dither_count_1.external_connection
add_interface pid_o_dither_count_2_external_connection conduit end
set_interface_property pid_o_dither_count_2_external_connection EXPORT_OF pid_o_dither_count_2.external_connection
add_interface pid_o_dither_count_3_external_connection conduit end
set_interface_property pid_o_dither_count_3_external_connection EXPORT_OF pid_o_dither_count_3.external_connection
add_interface pid_o_i0_external_connection conduit end
set_interface_property pid_o_i0_external_connection EXPORT_OF pid_o_i0.external_connection
add_interface pid_o_magic_external_connection conduit end
set_interface_property pid_o_magic_external_connection EXPORT_OF pid_o_magic.external_connection
add_interface pid_o_manual_dac_output_external_connection conduit end
set_interface_property pid_o_manual_dac_output_external_connection EXPORT_OF pid_o_manual_dac_output.external_connection
add_interface pid_o_out_offset_external_connection conduit end
set_interface_property pid_o_out_offset_external_connection EXPORT_OF pid_o_out_offset.external_connection
add_interface pid_o_pre_dither_manual_value_external_connection conduit end
set_interface_property pid_o_pre_dither_manual_value_external_connection EXPORT_OF pid_o_pre_dither_manual_value.external_connection
add_interface pid_o_q0_q4_external_connection conduit end
set_interface_property pid_o_q0_q4_external_connection EXPORT_OF pid_o_q0_q4.external_connection
add_interface pid_o_q1_q5_external_connection conduit end
set_interface_property pid_o_q1_q5_external_connection EXPORT_OF pid_o_q1_q5.external_connection
add_interface pid_o_q2_q6_external_connection conduit end
set_interface_property pid_o_q2_q6_external_connection EXPORT_OF pid_o_q2_q6.external_connection
add_interface pid_o_q3_q7_external_connection conduit end
set_interface_property pid_o_q3_q7_external_connection EXPORT_OF pid_o_q3_q7.external_connection
add_interface pid_o_test_10_external_connection conduit end
set_interface_property pid_o_test_10_external_connection EXPORT_OF pid_o_test_10.external_connection
add_interface pid_o_test_11_external_connection conduit end
set_interface_property pid_o_test_11_external_connection EXPORT_OF pid_o_test_11.external_connection
add_interface pid_o_test_12_external_connection conduit end
set_interface_property pid_o_test_12_external_connection EXPORT_OF pid_o_test_12.external_connection
add_interface pid_o_test_13_external_connection conduit end
set_interface_property pid_o_test_13_external_connection EXPORT_OF pid_o_test_13.external_connection
add_interface pid_o_test_14_external_connection conduit end
set_interface_property pid_o_test_14_external_connection EXPORT_OF pid_o_test_14.external_connection
add_interface pid_o_test_15_external_connection conduit end
set_interface_property pid_o_test_15_external_connection EXPORT_OF pid_o_test_15.external_connection
add_interface pid_o_test_16_external_connection conduit end
set_interface_property pid_o_test_16_external_connection EXPORT_OF pid_o_test_16.external_connection
add_interface pid_o_test_1_external_connection conduit end
set_interface_property pid_o_test_1_external_connection EXPORT_OF pid_o_test_1.external_connection
add_interface pid_o_test_2_external_connection conduit end
set_interface_property pid_o_test_2_external_connection EXPORT_OF pid_o_test_2.external_connection
add_interface pid_o_test_3_external_connection conduit end
set_interface_property pid_o_test_3_external_connection EXPORT_OF pid_o_test_3.external_connection
add_interface pid_o_test_4_external_connection conduit end
set_interface_property pid_o_test_4_external_connection EXPORT_OF pid_o_test_4.external_connection
add_interface pid_o_test_5_external_connection conduit end
set_interface_property pid_o_test_5_external_connection EXPORT_OF pid_o_test_5.external_connection
add_interface pid_o_test_6_external_connection conduit end
set_interface_property pid_o_test_6_external_connection EXPORT_OF pid_o_test_6.external_connection
add_interface pid_o_test_7_external_connection conduit end
set_interface_property pid_o_test_7_external_connection EXPORT_OF pid_o_test_7.external_connection
add_interface pid_o_test_8_external_connection conduit end
set_interface_property pid_o_test_8_external_connection EXPORT_OF pid_o_test_8.external_connection
add_interface pid_o_test_9_external_connection conduit end
set_interface_property pid_o_test_9_external_connection EXPORT_OF pid_o_test_9.external_connection
add_interface pid_o_y_input_external_connection conduit end
set_interface_property pid_o_y_input_external_connection EXPORT_OF pid_o_y_input.external_connection
add_interface pid_o_y_n_3_external_connection conduit end
set_interface_property pid_o_y_n_3_external_connection EXPORT_OF pid_o_y_n_3.external_connection
add_interface pid_o_y_n_4_external_connection conduit end
set_interface_property pid_o_y_n_4_external_connection EXPORT_OF pid_o_y_n_4.external_connection
add_interface pid_o_y_n_5_external_connection conduit end
set_interface_property pid_o_y_n_5_external_connection EXPORT_OF pid_o_y_n_5.external_connection
add_interface pid_o_y_n_6_external_connection conduit end
set_interface_property pid_o_y_n_6_external_connection EXPORT_OF pid_o_y_n_6.external_connection
add_interface pid_o_y_n_7_external_connection conduit end
set_interface_property pid_o_y_n_7_external_connection EXPORT_OF pid_o_y_n_7.external_connection
add_interface pid_o_y_n_external_connection conduit end
set_interface_property pid_o_y_n_external_connection EXPORT_OF pid_o_y_n.external_connection
add_interface pid_o_y_reference_external_connection conduit end
set_interface_property pid_o_y_reference_external_connection EXPORT_OF pid_o_y_reference.external_connection
add_interface pid_o_z_n_external_connection conduit end
set_interface_property pid_o_z_n_external_connection EXPORT_OF pid_o_z_n.external_connection
add_interface pid_version_external_connection conduit end
set_interface_property pid_version_external_connection EXPORT_OF pid_version.external_connection
add_interface recorder_i3_cs_external_connection conduit end
set_interface_property recorder_i3_cs_external_connection EXPORT_OF recorder_i3_cs.external_connection
add_interface recorder_i3_data_in_external_connection conduit end
set_interface_property recorder_i3_data_in_external_connection EXPORT_OF recorder_i3_data_in.external_connection
add_interface recorder_i3_read_external_connection conduit end
set_interface_property recorder_i3_read_external_connection EXPORT_OF recorder_i3_read.external_connection
add_interface recorder_i3_write_external_connection conduit end
set_interface_property recorder_i3_write_external_connection EXPORT_OF recorder_i3_write.external_connection
add_interface recorder_o3_data_out_external_connection conduit end
set_interface_property recorder_o3_data_out_external_connection EXPORT_OF recorder_o3_data_out.external_connection
add_interface recorder_o3_status_external_connection conduit end
set_interface_property recorder_o3_status_external_connection EXPORT_OF recorder_o3_status.external_connection
add_interface reset reset sink
set_interface_property reset EXPORT_OF clk_0.clk_in_reset

set_interconnect_requirement {$system} qsys_mm.clockCrossingAdapter HANDSHAKE
set_interconnect_requirement {$system} qsys_mm.maxAdditionalLatency 1

save_system soc_system.qsys
